# EAGLE design AD597 (EAGLE 8.5.0)
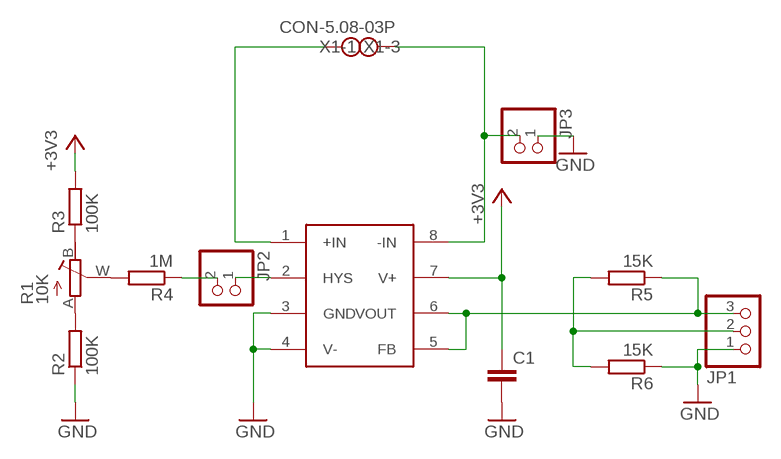
[diagram p0: schematic, sheet 1]

## Parts
C1  CAP_0805  [C0805]
JP1  PINHD-1X3/90  [1X03/90]
JP2  PINHD-1X2  [1X02]
JP3  PINHD-1X2  [1X02]
R1  10K  R_POTTURN-X  [RJ9W]
R2  100K  R_0805  [R0805]
R3  100K  R_0805  [R0805]
R4  1M  R_0805  [R0805]
R5  15K  R_0805  [R0805]
R6  15K  R_0805  [R0805]
U$1  AD597ARZ  [SO8]
X1  CON-5.08-03P  [MKDSN1,5/3-5,08]

## Nets
+3V3: C1.1 R3.2 U$1.7(V+)
GND: C1.2 JP1.1 JP3.1 R2.1 R6.1 U$1.3(GND) U$1.4(V-)
N$1: U$1.1(+IN) X1.3
N$2: JP3.2 U$1.8(-IN) X1.1
N$3: JP1.3 R5.1 U$1.5(FB) U$1.6(VOUT)
N$4: JP1.2 R5.2 R6.2
N$5: R1.A R2.2
N$6: R1.B(E) R3.1
N$7: R1.W(S) R4.2
N$8: JP2.2 R4.1
N$9: JP2.1 U$1.2(HYS)
Unconnected: X1.2

## Library data of the parts
C1 = Namenlos:CAP_
JP1 = pinhead:PINHD-1X3: PIN HEADER
JP2 JP3 = pinhead:PINHD-1X2: PIN HEADER
R1 = Namenlos:R_POT
R2-R6 = Namenlos:R_
U$1 = Namenlos:AD597
X1 = Namenlos:CON-5.08-03P: MKDSN 1,5/ 3-5,08 Printklemme Nennstrom: 13,5 A Nennspannung: 250 V Rastermaß: 5,08 mm Polzahl: 3 Anschlussart: Schraubanschluss Montage: Löten Anschlussrichtung Leiter/Platine: 0 ° Artikelnummer: 1729131 Source: http://eshop.phoenixcontact.com .. 1729131.pdf

## Board
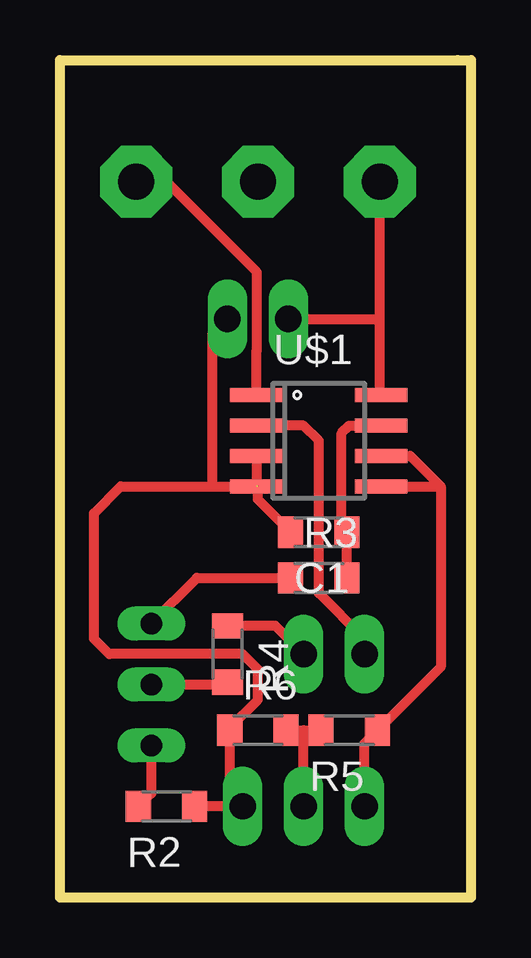
[diagram p1: board, top side]
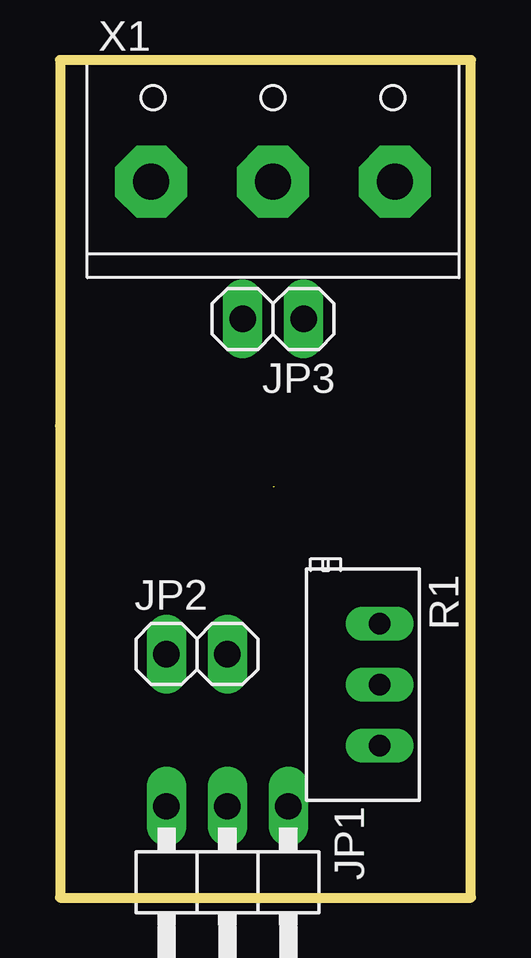
[diagram p2: board, bottom side, seen from below]

Size 17.14 x 34.92 mm. Coordinates in mm from the lower left corner, seen from the top.
Outline: 0,34.92 16.59,34.92 17.14,34.92 17.14,19.68 17.14,0 0,0 0,34.92
Copper layers (1*16): Top 0.035mm / dielectric 1.5mm / Bottom 0.035mm
Design rules "default": minimum track width 10mil, minimum drill 24mil, track to track 8mil, track to pad 8mil, pad to pad 8mil, via to via 8mil, smd to smd 8mil, copper to edge 40mil, drill to drill 8mil, minimum pad ring 10mil, minimum via ring 8mil, stop-mask expansion 4mil, vias tented up to drill 0mil, thermal gap 10mil

### Footprints (pad centres in the part's own frame; a part is rotated, then mirrored left to right if it is on the bottom)
C0805 = smd 1.05 x 1.3: 1 -1.175,0; 2 1.175,0
1X03/90 = drill 1.1 long: 1 -2.54,-3.81; 2 0,-3.81; 3 2.54,-3.81
1X02 = drill 1.1 long: 1 -1.27,0; 2 1.27,0
RJ9W = drill 0.9 long: A 2.54,0.635; B -2.54,0.635; W 0,0.635
R0805 = smd 1.05 x 1.3: 1 -1.175,0; 2 1.175,0
SO8 = smd 0.6 x 2.2: 1 -1.905,-2.6; 2 -0.635,-2.6; 3 0.635,-2.6; 4 1.905,-2.6; 5 1.905,2.6; 6 0.635,2.6; 7 -0.635,2.6; 8 -1.905,2.6
MKDSN1,5/3-5,08 = drill 1.5 pad 3 octagon: 1 -5.08,0; 2 0,0; 3 5.08,0

### Placement (x,y rotation side)
C1  10.79,15.24 180 top
JP1  10.16,0 180 bottom
JP2  11.43,10.16 0 bottom
JP3  8.26,24.13 180 bottom
R1  4.45,8.89 270 bottom
R2  4.45,3.81 180 top
R3  10.79,13.34 0 top
R4  6.98,10.16 270 top
R5  12.07,6.99 180 top
R6  8.26,6.99 0 top
U$1  10.79,19.05 270 top
X1  8.26,29.84 0 bottom

### Tracks (layer width: path | path; a pad name or v marks a point on that pad's centre or on a via)
+3V3
  Top 0.406: U$1.7 12.07,19.68 11.75,19.37 11.75,15.78 C1.1 R3.2
GND  (1 unrouted)
  Top 0.406: R2.1 JP1.1 7.08,4.35 R6.1 7.08,7.08 8.26,8.26 8.26,9.53 7.62,10.16 6.35,10.16 2.06,10.16 1.42,10.79 1.42,16.03 2.54,17.14 6.35,17.14 | U$1.3 U$1.4 | 6.35,17.14 8.26,17.14 | 8.26,17.14 8.89,17.14 | C1.2 8.26,16.61 8.26,17.14 | JP3.1 6.35,23.5 6.35,17.14
N$1
  Top 0.406: U$1.1 8.2,22.77 8.22,22.8 8.22,26.07 4.45,29.84 X1.3
N$2
  Top 0.406: U$1.8 13.34,21.02 13.34,24.13 | 13.34,24.13 X1.1 | JP3.2 13.34,24.13
N$3
  Top 0.406: JP1.3 12.7,6.45 R5.1 15.88,9.62 15.88,17.14 | U$1.6 14.61,18.41 15.88,17.14 | U$1.5 15.88,17.14
N$4
  Top 0.406: R6.2 10.16,6.99 | 10.16,6.99 R5.2 | JP1.2 10.16,6.99
N$5
  Top 0.406: R1.A 3.81,4.35 R2.2
N$6
  Top 0.406: R1.B 5.71,13.34 R3.1
N$7
  Top 0.406: R1.W 6.89,8.89 R4.2
N$8
  Top 0.406: JP2.2 8.98,11.34 R4.1
N$9
  Top 0.406: U$1.2 10.16,19.68 10.79,19.05 10.79,12.7 12.7,10.79 JP2.1